# Altium schematic sheet STM32H7_PART_4.SchDoc
size A; Organization: Altium Limited; Address1: L3, 12a Rodborough Rd; Address2: Frenchs Forest; Address3: NSW; Address4: Australia 2086
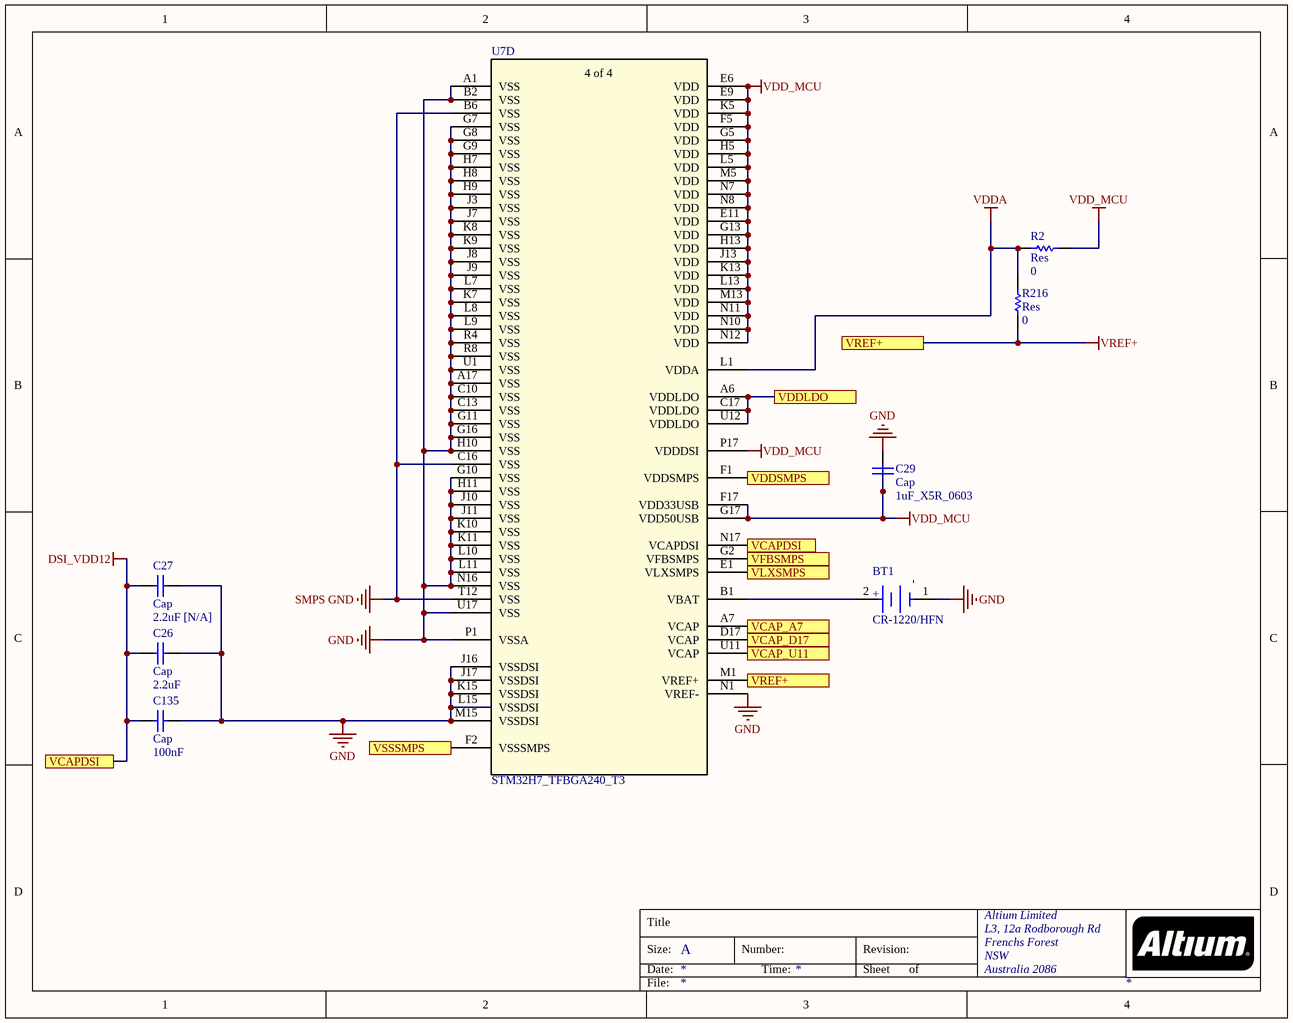
[diagram p0: STM32H7_PART_4.SchDoc]

## Parts
BT1  CR-1220/HFN  [FP-CR-1220-HFN-MFG]
C26  Cap  value 2.2uF  [RAD-0.3]
C27  Cap  value 2.2uF [N/A]  [RAD-0.3]
C29  Cap  value 1uF_X5R_0603  [RAD-0.3]
C135  Cap  value 100nF  [RAD-0.3]
R2  Res  value 0  [AXIAL-0.3]
R216  Res  value 0  [AXIAL-0.3]
U7  STM32H7_TFBGA240_T3  [TFBGA240+25]  (part D of 4)

## Ports
VCAP_A7, VCAP_D17, VCAP_U11, VCAPDSI, VDDLDO, VDDSMPS, VFBSMPS, VLXSMPS, VREF+, VSSSMPS

## Nets
DSI_VDD12: C26.1 C27.1 C135.1 U7.N17(VCAPDSI) ; port VCAPDSI
GND: BT1.1(C) C26.2 C27.2 C29.2 C135.2 U7.A1(VSS) U7.A17(VSS) U7.B2(VSS) U7.C10(VSS) U7.C13(VSS) U7.G7(VSS) U7.G8(VSS) U7.G9(VSS) U7.G10(VSS) U7.G11(VSS) U7.G16(VSS) U7.H7(VSS) U7.H8(VSS) U7.H9(VSS) U7.H10(VSS) U7.H11(VSS) U7.J3(VSS) U7.J7(VSS) U7.J8(VSS) U7.J9(VSS) U7.J10(VSS) U7.J11(VSS) U7.J16(VSSDSI) U7.J17(VSSDSI) U7.K7(VSS) U7.K8(VSS) U7.K9(VSS) U7.K10(VSS) U7.K11(VSS) U7.K15(VSSDSI) U7.L7(VSS) U7.L8(VSS) U7.L9(VSS) U7.L10(VSS) U7.L11(VSS) U7.L15(VSSDSI) U7.M15(VSSDSI) U7.N1(VREF-) U7.N16(VSS) U7.P1(VSSA) U7.R4(VSS) U7.R8(VSS) U7.U1(VSS) U7.U17(VSS)
SMPS GND: U7.B6(VSS) U7.C16(VSS) U7.T12(VSS)
VDD_MCU: C29.1 R2.2 U7.E6(VDD) U7.E9(VDD) U7.E11(VDD) U7.F5(VDD) U7.F17(VDD33USB) U7.G5(VDD) U7.G13(VDD) U7.G17(VDD50USB) U7.H5(VDD) U7.H13(VDD) U7.J13(VDD) U7.K5(VDD) U7.K13(VDD) U7.L5(VDD) U7.L13(VDD) U7.M5(VDD) U7.M13(VDD) U7.N7(VDD) U7.N8(VDD) U7.N10(VDD) U7.N11(VDD) U7.N12(VDD) U7.P17(VDDDSI)
VDDA: R2.1 R216.2 U7.L1(VDDA)
VREF+: R216.1 U7.M1(VREF+) ; port VREF+
VCAP_A7: U7.A7(VCAP) ; port VCAP_A7
VCAP_D17: U7.D17(VCAP) ; port VCAP_D17
VCAP_U11: U7.U11(VCAP) ; port VCAP_U11
VDDLDO: U7.A6(VDDLDO) U7.C17(VDDLDO) U7.U12(VDDLDO) ; port VDDLDO
VDDSMPS: U7.F1(VDDSMPS) ; port VDDSMPS
VFBSMPS: U7.G2(VFBSMPS) ; port VFBSMPS
VLXSMPS: U7.E1(VLXSMPS) ; port VLXSMPS
VSSSMPS: U7.F2(VSSSMPS) ; port VSSSMPS
NetBT1_2: BT1.2(A) U7.B1(VBAT)

## Notes on the sheet
- Title
- Size:
- Date:
- A
- Number:
- Time:
- Revision:
- Sheet
- of
- File:
- (in symbol CMP-05417-000010-1) -; +
- (in symbol STM32H7_TFBGA240, part D) 4 of 4

## Library data of the parts
BT1 = CMP-05417-000010-1: BATTERY LITHIUM 3V COIN 12.5MM; Manufacturer: Panasonic; Standoff Height: 2.9mm; Temperature Range High: +60°C; Temperature: -30°C to +60°C; Device Class L2: unset; Height: 5.5mm; Category: Batt; Device Class L3: unset; Package: CR-1220/HFN; ComponentLink2URL: https://industrial.panasonic.com/cdbs/www-data/pdf2/AAA4000/AAA4000D138.PDF; ComponentLink2Description: Datasheet; Temperature Range Low: -30°C; Mouser Description: CR1220 Series Ø 12.5 mm 3 V 35 mAh Non-Rechargeable Lithium Coin Cell Battery; Octopart: https://octopart.com/cr-1220%2Fhfn-panasonic-13183313; Manufacturer Part Number: CR-1220/HFN; Automotive: No; Digikey Description: BATTERY LITHIUM 3V COIN 12.5MM; Device Class L1: Passive Components
C26 C27 C29 C135 = Cap: Capacitor; Published: 8-Jun-2000; LatestRevisionDate: 17-Jul-2002; LatestRevisionNote: Re-released for DXP Platform.; PackageReference: RAD-0.3; Publisher: Altium Limited; PackageDescription: Radial Cap, Thru-Hole; 2 Leads; 0.3 in Pin Spacing
R2 R216 = Res1: Resistor; Published: 8-Jun-2000; LatestRevisionDate: 17-Jul-2002; LatestRevisionNote: Re-released for DXP Platform.; PackageReference: AXIAL-0.3; Publisher: Altium Limited; PackageDescription: Axial Device, Thru-Hole; 2 Leads; 0.3 in Pin Spacing
U7 = STM32H7_TFBGA240: No Description Available; Vendor: STMicroelectronics; Copyright: Copyright (C) 2018 Accelerated Designs. All rights reserved; Manufacturer_Part_Number: STM32H7_TFBGA240_T3; RefDes: RefDes; Type: DEV